# Altium schematic sheet I2S Select.SchDoc
size Tabloid; ApprovedBy: NA
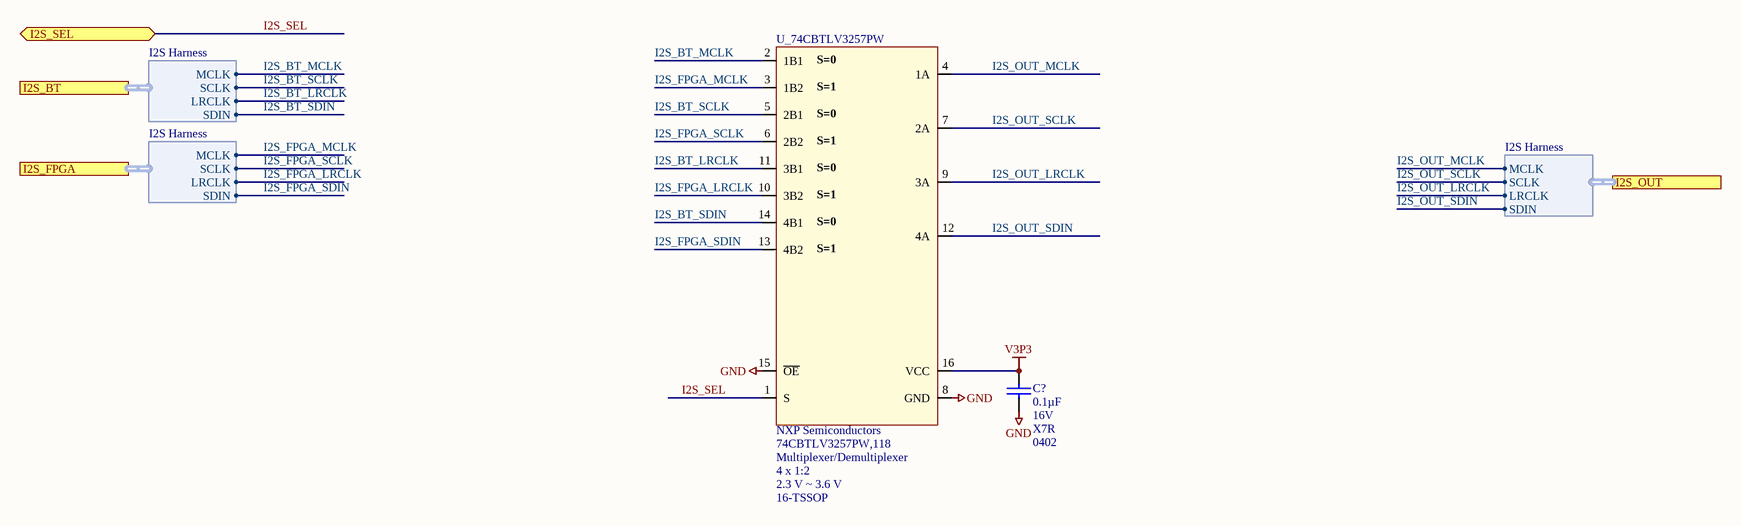
[diagram p0: I2S Select.SchDoc]

## Parts
C?  Capacitance: 0.1µF  Voltage - Rated: 16V  Temperature Coefficient: X7R  Package / Case: 0402  [C_ERA-0402]  (hidden comment: 0.1uF)
U_74CBTLV3257PW  Manufacturer: NXP Semiconductors  Manufacturer Part Number: 74CBTLV3257PW,118  Type: Multiplexer/Demultiplexer  Circuit: 4 x 1:2  Voltage - Supply: 2.3 V ~ 3.6 V  Supplier Device Package: 16-TSSOP  [TSOP65P640X110-16N]  (hidden comment: U_IDT74CBTLV3244)

## Ports
I2S_BT (harness I2S Harness), I2S_FPGA (harness I2S Harness), I2S_OUT (harness I2S Harness), I2S_SEL

## Harnesses
I2S Harness: MCLK, SCLK, LRCLK, SDIN

## Nets
GND: C?.1 U_74CBTLV3257PW.8(GND) U_74CBTLV3257PW.15(~{OE})
V3P3: C?.2 U_74CBTLV3257PW.16(VCC)
I2S_BT_LRCLK: U_74CBTLV3257PW.11(3B1) ; port I2S_BT.LRCLK
I2S_BT_MCLK: U_74CBTLV3257PW.2(1B1) ; port I2S_BT.MCLK
I2S_BT_SCLK: U_74CBTLV3257PW.5(2B1) ; port I2S_BT.SCLK
I2S_BT_SDIN: U_74CBTLV3257PW.14(4B1) ; port I2S_BT.SDIN
I2S_FPGA_LRCLK: U_74CBTLV3257PW.10(3B2) ; port I2S_FPGA.LRCLK
I2S_FPGA_MCLK: U_74CBTLV3257PW.3(1B2) ; port I2S_FPGA.MCLK
I2S_FPGA_SCLK: U_74CBTLV3257PW.6(2B2) ; port I2S_FPGA.SCLK
I2S_FPGA_SDIN: U_74CBTLV3257PW.13(4B2) ; port I2S_FPGA.SDIN
I2S_OUT_LRCLK: U_74CBTLV3257PW.9(3A) ; port I2S_OUT.LRCLK
I2S_OUT_MCLK: U_74CBTLV3257PW.4(1A) ; port I2S_OUT.MCLK
I2S_OUT_SCLK: U_74CBTLV3257PW.7(2A) ; port I2S_OUT.SCLK
I2S_OUT_SDIN: U_74CBTLV3257PW.12(4A) ; port I2S_OUT.SDIN
I2S_SEL: U_74CBTLV3257PW.1(S) ; port I2S_SEL

## Notes on the sheet
- Project:
- http://www.cospandesign.com
- Cospan Design
- Document:
- Engineer:
- Title:
- Client:
- Approved By:
- Revision:
- Date:
- Number:
- of
- (in symbol U_IDT74CBTLV3244) S=0; S=1

## Library data of the parts
C? = C_0402_0.1UF_16V: CAP CER .10UF 16V X7R 0402; Manufacturer: TDK Corporation; Manufacturer Part Number: C1005X7R1C104K; Tolerance: ±10%; Supplier 1: Digi-Key; Supplier Part Number 1: 445-4952-1-ND; RoHS: RoHS Compliant; Category: Capacitors; Stock 1: 230800; Pricing: 10=0.024, 100=0.0143, 500=0.00826, 1000=0.00572 (USD); Mounting Type: Surface Mount, MLCC; Features: General Purpose; Lead Spacing: -; Thickness: 0.50mm; Packaging: Cut Tape (CT); ComponentLink1URL: http://www.tdk.co.jp/tefe02/e412_c.pdf; ComponentLink1Description: http://www.tdk.co.jp/tefe02/e412_c.pdf; Operating Temperature: -55°C ~ 125°C
U_74CBTLV3257PW = U_IDT74CBTLV3244: IC MUX/DEMUX DUAL 1OF4 16TSSOP; Independent Circuits: 1; Current - Output High, Low: 24mA, 64mA; Voltage Supply Source: Single Supply; Supplier 1: Digi-Key; RoHS: RoHS Compliant; Category: Integrated Circuits (ICs); Stock 1: 5316; Pricing 1: 1=0.6, 10=0.525, 25=0.4652, 100=0.405, 250=0.35252, 500=0.3, 1000=0.24 (USD); Operating Temperature: -40°C ~ 125°C; Mounting Type: Surface Mount; Package / Case: 16-TSSOP (0.173", 4.40mm Width); Packaging: Cut Tape (CT); ComponentLink1URL: http://www.nxp.com/documents/data_sheet/74CBTLV3257.pdf; ComponentLink1Description: http://www.nxp.com/documents/data_sheet/74CBTLV3257.pdf; Supplier Part Number 1: 568-5270-1-ND